# EAGLE design LPC_1TE_3.42 (EAGLE 5.10)
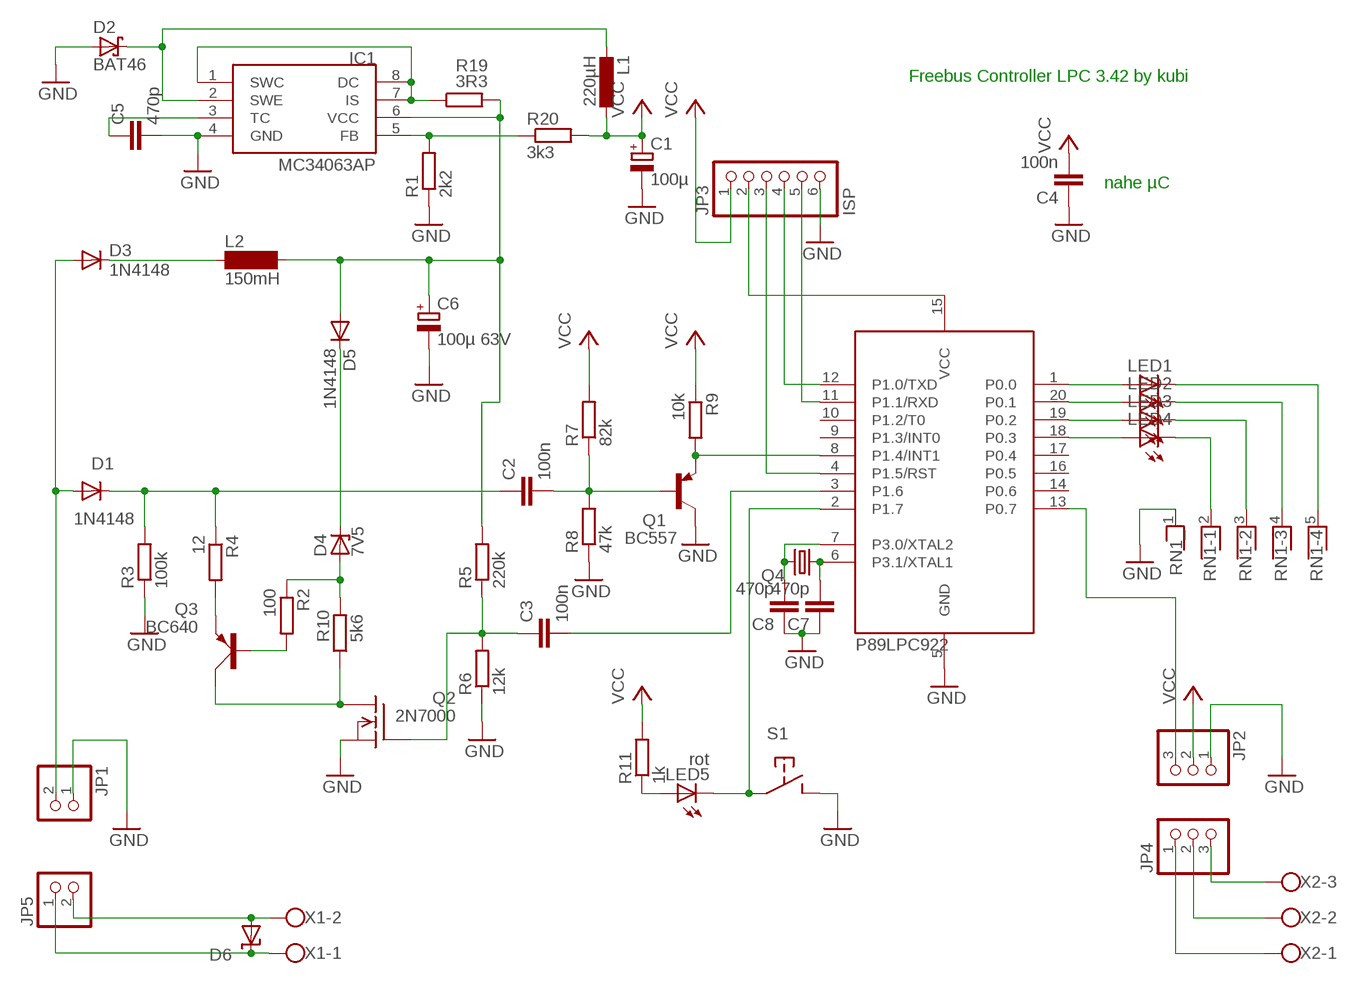
[diagram p0: schematic, sheet 1]

## Parts
C1  100µ  CPOL-EUE5-8.5  [E5-8,5]
C2  100n  C-EU050-024X044  [C050-024X044]
C3  100n  C-EU050-024X044  [C050-024X044]
C4  100n  C-EU050-024X044  [C050-024X044]
C5  470p  C-EU025-024X044  [C025-024X044]
C6  100µ 63V  CPOL-EUE5-10.5  [E5-10,5]
C7  470p  C-EU025-024X044  [C025-024X044]
C8  470p  C-EU025-024X044  [C025-024X044]
D1  1N4148  [DO35-10]
D2  BAT46  BAT49  [DO41-10]
D3  1N4148  [DO35-10]
D4  7V5  ZPD  [DO35Z10]
D5  1N4148  [DO35-10]
D6  SUPPRESSOR-SMBJ  [SMBJ]
IC1  MC34063AP  [DIL08]
JP1  PINHD-1X2  [1X02]
JP2  PINHD-1X3  [1X03]
JP3  ISP  PINHD-1X6  [1X06]
JP4  PINHD-1X3  [1X03]
JP5  PINHD-1X2  [1X02]
L1  220µH  L-EU2200-12.7  [2200-12.7]
L2  150mH  SD12K100  [SD12K100]
LED1  LED3MM  [LED3MM]
LED2  LED3MM  [LED3MM]
LED3  LED3MM  [LED3MM]
LED4  LED3MM  [LED3MM]
LED5  rot  LED3MM  [LED3MM]
Q1  BC557  [TO92]
Q2  2N7000  VN2222KM  [TO237]
Q3  BC640  [SOT54D]
Q4  CRYSTALHC49U-V  [HC49U-V]
R1  2k2  R-EU_0207/10  [0207/10]
R2  100  R-EU_0207/10  [0207/10]
R3  100k  R-EU_0207/10  [0207/10]
R4  12  R-EU_0207/10  [0207/10]
R5  220k  R-EU_0207/10  [0207/10]
R6  12k  R-EU_0207/10  [0207/10]
R7  82k  R-EU_0207/10  [0207/10]
R8  47k  R-EU_0207/10  [0207/10]
R9  10k  R-EU_0207/10  [0207/10]
R10  5k6  R-EU_0207/10  [0207/10]
R11  1k  R-EU_0207/10  [0207/10]
R19  3R3  R-EU_0207/10  [0207/10]
R20  3k3  R-EU_0207/10  [0207/10]
RN1  RNX4  [RN-5]
S1  3305  [3305]
U1  89LPC922  [DIL20]
X1  W237-02P  [W237-132]
X2  W237-03P  [W237-133]

## Nets
GND: C1.- C4.1 C5.2 C6.- C7.1 C8.1 D2.A IC1.4(GND) JP1.1 JP2.1 JP3.6 Q1.3(C) Q2.3(S) R1.1 R3.1 R6.1 R8.1 RN1.1 S1.P$2 U1.5(GND)
N$1: Q1.1(E) R9.2 U1.8(P1.4/INT1)
N$2: C2.2 Q1.2(B) R7.1 R8.2
N$3: IC1.5(FB) R1.2 R20.1
N$4: IC1.1(SWC) IC1.7(IS) IC1.8(DC) R19.1
N$5: C3.2 U1.3(P1.6)
N$6: Q2.1(D) Q3.C R10.1
N$7: C6.+ D5.A IC1.6(VCC) L2.2 R5.2 R19.2
N$8: D3.C L2.1
N$9: C2.1 D1.C R3.2 R4.1
N$10: D2.C IC1.2(SWE) L1.2
N$11: D4.A R2.1 R10.2
N$12: Q3.E R4.2
N$13: C5.1 IC1.3(TC)
N$14: Q3.B R2.2
N$15: LED5.K(C) S1.P$1 U1.2(P1.7)
N$16: D1.A D3.A JP1.2
N$17: D6.A JP5.2 X1.2
N$18: D6.C JP5.1 X1.1
N$19: JP4.3 X2.3
N$20: LED1.A U1.1(P0.0)
N$21: LED2.A U1.20(P0.1)
N$22: LED3.A U1.19(P0.2)
N$23: LED4.A U1.18(P0.3)
N$24: C7.2 Q4.1 U1.6(P3.1/XTAL1)
N$25: C8.2 Q4.2 U1.7(P3.0/XTAL2)
N$26: JP4.2 X2.2
N$27: JP4.1 X2.1
N$28: JP2.3 U1.13(P0.7)
N$29: JP3.4 U1.12(P1.0/TXD)
N$30: JP3.5 U1.11(P1.1/RXD)
N$31: JP3.3 U1.4(P1.5/RST)
N$32: JP3.2 U1.15(VCC)
N$34: C3.1 Q2.2(G) R5.1 R6.2
N$37: LED4.K(C) RN1.2
N$38: LED3.K(C) RN1.3
N$39: LED2.K(C) RN1.4
N$40: D4.C D5.C
N$41: LED5.A R11.1
N$42: LED1.K(C) RN1.5
VCC: C1.+ C4.2 JP2.2 JP3.1 L1.1 R7.2 R9.1 R11.2 R20.2
Unconnected: U1.9(P1.3/INT0) U1.10(P1.2/T0) U1.14(P0.6) U1.16(P0.5) U1.17(P0.4)

## Notes on the sheet
- Freebus Controller LPC 3.42 by kubi
- nahe µC
- P89LPC922

## Library data of the parts
C1 C6 = rcl:CPOL-EU: POLARIZED CAPACITOR, European symbol
C2-C5 C7 C8 = rcl:C-EU: CAPACITOR, European symbol
D1 D3 D5 = diode:1N4148: DIODE high speed (Philips)
D2 = diode:BAT49: DIODE small signal diode
D4 = diode:ZPD: Z DIODE 500 mW
D6 = diode:SUPPRESSOR-: Suppressor diode
IC1 = mc34063:MC34063
JP1 JP5 = pinhead:PINHD-1X2: PIN HEADER
JP2 JP4 = pinhead:PINHD-1X3: PIN HEADER
JP3 = pinhead:PINHD-1X6: PIN HEADER
L1 = rcl:L-EU: INDUCTOR, European symbol
L2 = inductor-neosid:SD12: INDUCTOR nominal inductance
LED1-LED5 = led:LED: LED OSRAM: - CHIPLED LG R971, LG N971, LY N971, LG Q971, LY Q971, LO R971, LY R971 LH N974, LH R974 LS Q976, LO Q976, LY Q976 LO Q996 - Hyper CHIPLED LW Q18S LB Q993, LB Q99A, LB R99A - SideLED LS A670, LO A670, LY A670, LG A670, LP A670 LB A673, LV A673, LT A673, LW A673 LH A674 LY A675 LS A676, LA A676, LO A676, LY A676, LW A676 LS A679, LY A679, LG A679 - Hyper Micro SIDELED® LS Y876, LA Y876, LO Y876, LY Y876 LT Y87S - SmartLED LW L88C, LW L88S LB L89C, LB L89S, LG L890 LS L89K, LO L89K, LY L89K LS L896, LA L896, LO L896, LY L896 - TOPLED LS T670, LO T670, LY T670, LG T670, LP T670 LSG T670, LSP T670, LSY T670, LOP T670, LYG T670 LG T671, LOG T671, LSG T671 LB T673, LV T673, LT T673, LW T673 LH T674 LS T676, LA T676, LO T676, LY T676, LB T676, LH T676, LSB T676, LW T676 LB T67C, LV T67C, LT T67C, LS T67K, LO T67K, LY T67K, LW E67C LS E67B, LA E67B, LO E67B, LY E67B, LB E67C, LV E67C, LT E67C LW T67C LS T679, LY T679, LG T679 LS T770, LO T770, LY T770, LG T770, LP T770 LB T773, LV T773, LT T773, LW T773 LH T774 LS E675, LA E675, LY E675, LS T675 LS T776, LA T776, LO T776, LY T776, LB T776 LHGB T686 LT T68C, LB T68C - Hyper Mini TOPLED® LB M676 - Mini TOPLED Santana® LG M470 LS M47K, LO M47K, LY M47K Source: http://www.osram.convergy.de - LUMILED® LXK2-PW12-R00, LXK2-PW12-S00, LXK2-PW14-U00, LXK2-PW14-V00 LXK2-PM12-R00, LXK2-PM12-S00, LXK2-PM14-U00 LXK2-PE12-Q00, LXK2-PE12-R00, LXK2-PE12-S00, LXK2-PE14-T00, LXK2-PE14-U00 LXK2-PB12-K00, LXK2-PB12-L00, LXK2-PB12-M00, LXK2-PB14-N00, LXK2-PB14-P00, LXK2-PB14-Q00 LXK2-PR12-L00, LXK2-PR12-M00, LXK2-PR14-Q00, LXK2-PR14-R00 LXK2-PD12-Q00, LXK2-PD12-R00, LXK2-PD12-S00 LXK2-PH12-R00, LXK2-PH12-S00 LXK2-PL12-P00, LXK2-PL12-Q00, LXK2-PL12-R00 Source: www.luxeon.com
Q1 = transistor-pnp:BC557: PNP Transistor
Q2 = transistor-fet:VN2222KM: N-Channel Enhancement MOSFET (VMOS); 60V; 0,5A; 7,5Ohm
Q3 = transistor-small-signal:BC640: PNP TRANSISTOR
Q4 = crystal:CRYSTAL: CRYSTAL
R1-R11 R19 R20 = rcl:R-EU_: RESISTOR, European symbol
RN1 = resistor-net:RNX4: RESISTOR NETWORK
S1 = kubi:3305: Taster 3305
U1 = micro-philips:89LPC922
X1 = con-wago-508:W237-02P: WAGO SREW CLAMP
X2 = con-wago-508:W237-03P: WAGO SREW CLAMP

## Board
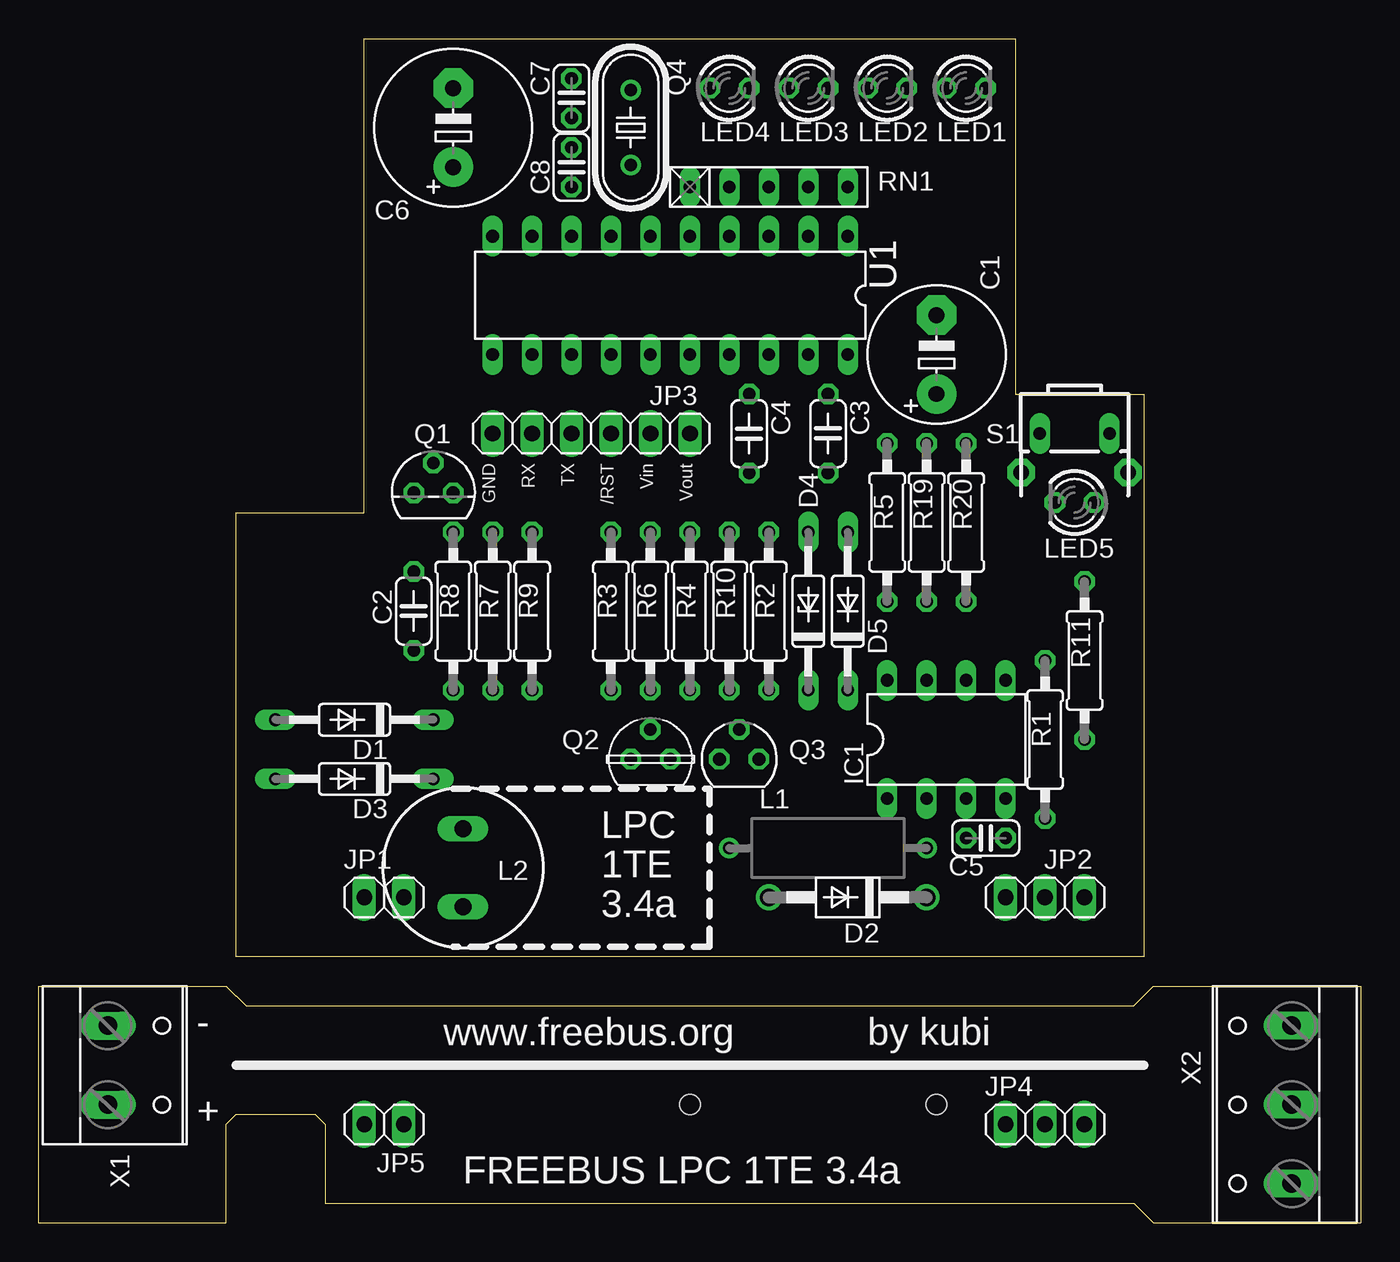
[diagram p1: board, top side]
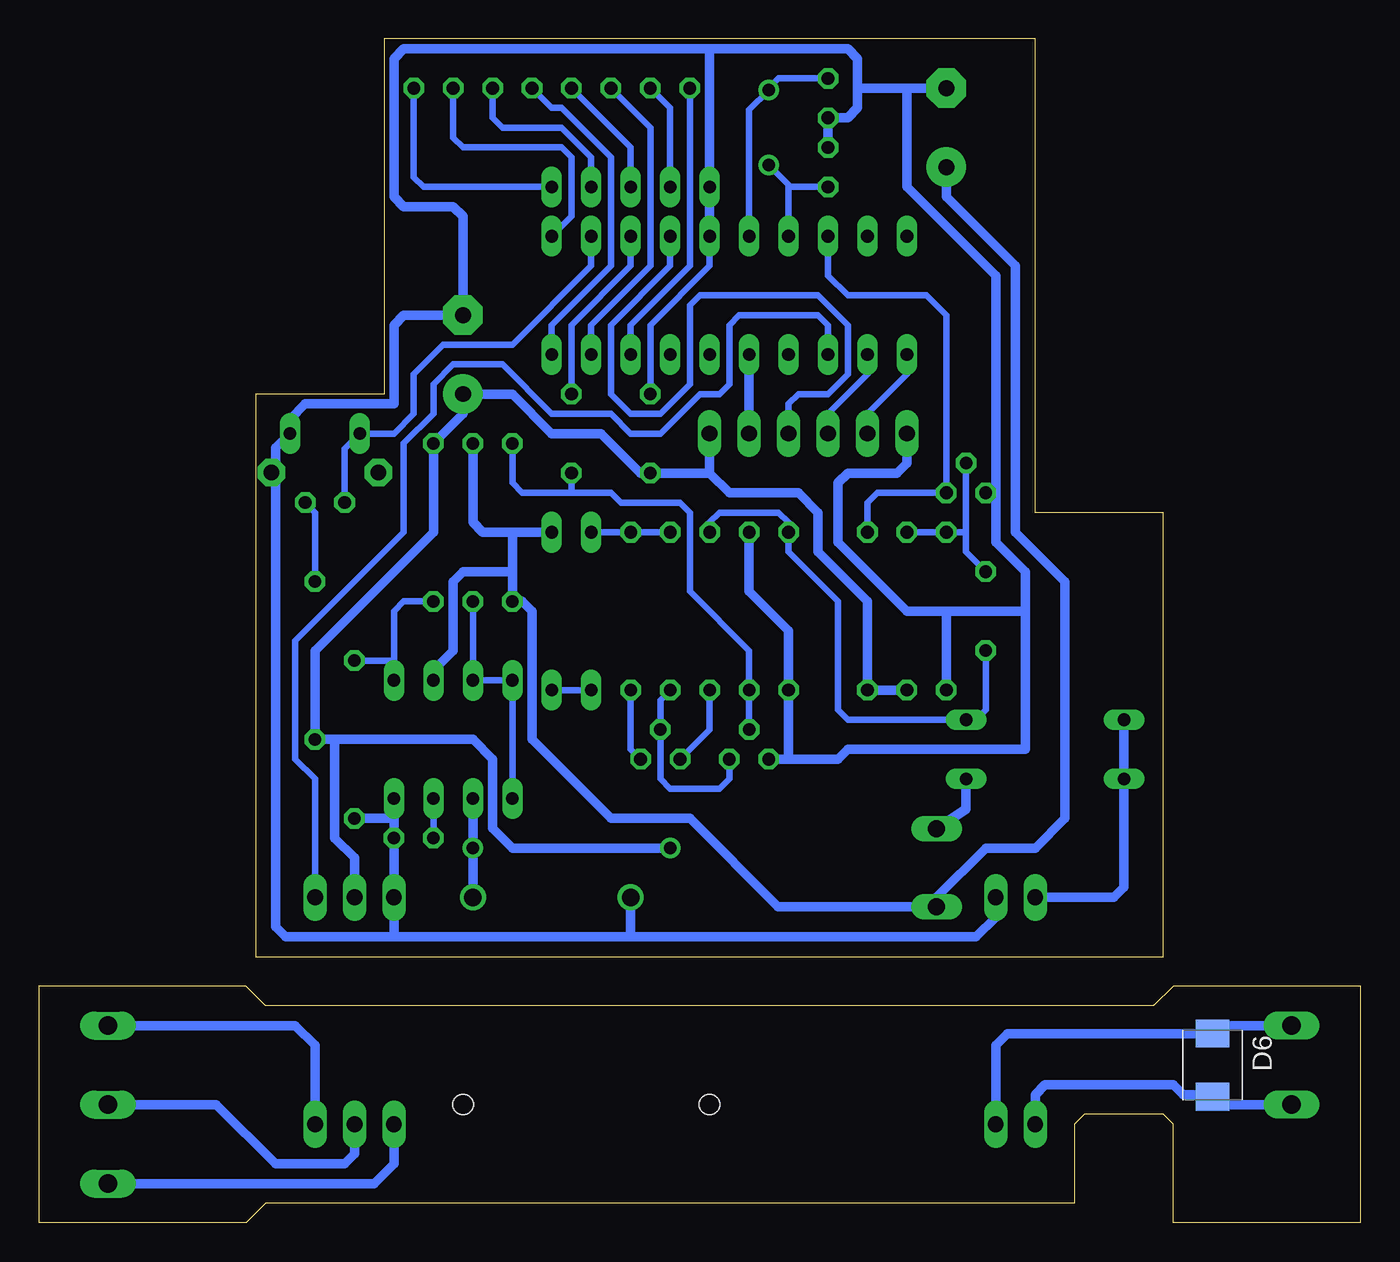
[diagram p2: board, bottom side, seen from below]

Size 85.09 x 76.2 mm. Coordinates in mm from the lower left corner, seen from the top.
Outline: 12.7,17.14 12.7,45.72 20.95,45.72 20.95,76.2 62.87,76.2 62.87,53.34 71.12,53.34 71.12,17.14 12.7,17.14
Outline: 0,0 12.06,0 12.06,6.35 12.7,6.98 17.78,6.98 18.41,6.35 18.41,1.27 70.48,1.27 71.75,0 85.09,0 85.09,15.24 71.75,15.24 70.48,13.97 13.34,13.97 12.06,15.24 0,15.24 0,0
Copper layers (1*16): Top 0.035mm / dielectric 1.5mm / Bottom 0.035mm
Design rules "default *": minimum track width 10mil, minimum drill 24mil, track to track 12mil, track to pad 10mil, pad to pad 12mil, via to via 12mil, smd to smd 8mil, copper to edge 10mil, drill to drill 8mil, minimum pad ring 10mil, minimum via ring 8mil, stop-mask expansion 4mil, vias tented up to drill 0mil, thermal gap 10mil
Holes 1.3 mm at 57.79,7.62 41.91,7.62

### Footprints (pad centres in the part's own frame; a part is rotated, then mirrored left to right if it is on the bottom)
E5-8,5 = drill 1.016 pad 2.54 round: + -2.54,0 | drill 1.016 pad 2.54 octagon: - 2.54,0
C050-024X044 = drill 0.813 octagon: 1 -2.54,0; 2 2.54,0
C025-024X044 = drill 0.813 octagon: 1 -1.27,0; 2 1.27,0
E5-10,5 = drill 1.016 pad 2.54 round: + -2.54,0 | drill 1.016 pad 2.54 octagon: - 2.54,0
DO35-10 = drill 0.813 long: A 5.08,0; C -5.08,0
DO41-10 = drill 1.118 round: A 5.08,0; C -5.08,0
DO35Z10 = drill 0.813 long: A 5.08,0; C -5.08,0
SMBJ = smd 1.78 x 2.16: A 2.04,0; C -2.03,0
DIL08 = drill 0.813 long: 1 -3.81,-3.81; 2 -1.27,-3.81; 3 1.27,-3.81; 4 3.81,-3.81; 5 3.81,3.81; 6 1.27,3.81; 7 -1.27,3.81; 8 -3.81,3.81
1X02 = drill 1.016 long: 1 -1.27,0; 2 1.27,0
1X03 = drill 1.016 long: 1 -2.54,0; 2 0,0; 3 2.54,0
1X06 = drill 1.016 long: 1 -6.35,0; 2 -3.81,0; 3 -1.27,0; 4 1.27,0; 5 3.81,0; 6 6.35,0
2200-12.7 = drill 0.8 pad 1.27 round: 1 -6.35,0; 2 6.35,0
SD12K100 = drill 1.1 long: 1 -2.5,0; 2 2.5,0
LED3MM = drill 0.813 octagon: A -1.27,0; K 1.27,0
TO92 = drill 0.813 octagon: 1 1.27,0; 2 0,1.905; 3 -1.27,0
TO237 = drill 0.813 octagon: 1 1.27,0; 2 0,1.905; 3 -1.27,0
SOT54D = drill 0.813 octagon: B 1.27,0; C 0,1.905; E -1.27,0
HC49U-V = drill 0.813 round: 1 -2.413,0; 2 2.413,0
0207/10 = drill 0.813 octagon: 1 -5.08,0; 2 5.08,0
RN-5 = drill 0.813 long: 1 -5.08,0; 2 -2.54,0; 3 0,0; 4 2.54,0; 5 5.08,0
3305 = drill 0.8 long: P$1 -2.25,0; P$2 2.25,0 | drill 1 pad 1.778 octagon: P$3 -3.45,-2.5; P$4 3.45,-2.5
DIL20 = drill 0.813 long: 1 -11.43,-3.81; 2 -8.89,-3.81; 3 -6.35,-3.81; 4 -3.81,-3.81; 5 -1.27,-3.81; 6 1.27,-3.81; 7 3.81,-3.81; 8 6.35,-3.81; 9 8.89,-3.81; 10 11.43,-3.81; 11 11.43,3.81; 12 8.89,3.81; 13 6.35,3.81; 14 3.81,3.81; 15 1.27,3.81; 16 -1.27,3.81; 17 -3.81,3.81; 18 -6.35,3.81; 19 -8.89,3.81; 20 -11.43,3.81
W237-132 = drill 1.194 long: 1 -2.54,-0.635; 2 2.54,-0.635
W237-133 = drill 1.194 long: 1 -5.08,-0.635; 2 0,-0.635; 3 5.08,-0.635

### Placement (x,y rotation side)
C1  57.79,55.88 90 top
C2  24.13,39.37 90 top
C3  50.8,50.8 90 top
C4  45.72,50.8 270 top
C5  60.96,24.77 0 top
C6  26.67,70.48 90 top
C7  34.29,72.39 90 top
C8  34.29,67.94 270 top
D1  20.32,32.38 180 top
D2  52.07,20.95 180 top
D3  20.32,28.57 180 top
D4  49.53,39.37 90 top
D5  52.07,39.37 90 top
D6  9.53,10.16 270 bottom
IC1  58.42,31.11 0 top
JP1  22.22,20.95 180 top
JP2  64.77,20.95 0 top
JP3  35.56,50.8 180 top
JP4  64.77,6.35 0 top
JP5  22.22,6.35 180 top
L1  50.8,24.13 0 top
L2  27.3,22.86 270 top
LED1  59.69,73.02 0 top
LED2  54.61,73.02 0 top
LED3  49.53,73.02 0 top
LED4  44.45,73.02 0 top
LED5  66.67,46.36 180 top
Q1  25.4,46.99 0 top
Q2  39.37,29.84 0 top
Q3  45.09,29.84 0 top
Q4  38.1,70.48 270 top
R1  64.77,31.11 90 top
R2  46.99,39.37 270 top
R3  36.83,39.37 90 top
R4  41.91,39.37 270 top
R5  54.61,45.09 270 top
R6  39.37,39.37 270 top
R7  29.21,39.37 270 top
R8  26.67,39.37 90 top
R9  31.75,39.37 90 top
R10  44.45,39.37 90 top
R11  67.31,36.2 270 top
R19  57.15,45.09 90 top
R20  59.69,45.09 90 top
RN1  46.99,66.67 0 top
S1  66.67,50.8 0 top
U1  40.64,59.69 180 top
X1  5.08,10.16 270 top
X2  80.01,7.62 90 top

### Tracks (layer width: path | path; a pad name or v marks a point on that pad's centre or on a via)
GND
  Bottom 0.406: U1.5 41.91,61.6 45.72,57.79 C4.1
  Bottom 0.61: JP3.6 29.21,48.9 29.84,48.26 33.02,48.26 33.66,47.62 33.66,43.82 29.21,39.37 26.67,39.37 | 23.49,46.99 Q1.3 | R6.1 39.37,40.64 36.83,38.1 R3.1 36.83,29.84 | 36.83,29.84 Q2.3 | 62.23,26.04 C5.2 JP2.1 62.23,18.41 | 62.23,26.04 IC1.4 | U1.5 RN1.1 41.91,75.56 | 62.23,26.04 R1.1 | 41.91,75.56 61.59,75.56 62.23,74.93 62.23,66.04 61.59,65.41 58.42,65.41 57.79,64.77 C1.- 61.59,58.42 62.23,57.79 62.23,52.71 67.94,52.71 68.92,51.73 S1.P$2 69.85,49.88 69.85,19.05 69.21,18.41 62.23,18.41 | 26.67,39.37 R8.1 | 36.83,29.84 33.66,29.84 33.02,30.48 21.59,30.48 21.59,39.37 | JP1.1 23.49,19.68 24.76,18.41 46.99,18.41 | C8.1 C7.1 33.02,71.12 32.39,71.75 32.39,73.02 | 32.39,73.02 32.39,74.93 33.02,75.56 41.91,75.56 | 32.39,73.02 29.21,73.02 | 29.21,73.02 C6.- | 29.21,73.02 29.21,66.67 23.49,60.96 23.49,46.99 | 23.49,46.99 23.49,43.82 21.59,41.91 21.59,39.37 | 21.59,39.37 26.67,39.37 | 46.99,18.41 D2.A | 46.99,18.41 62.23,18.41
N$1
  Bottom 0.406: U1.8 34.29,60.96 33.02,59.69 27.94,59.69 26.67,58.42 Q1.1 31.11,46.99 31.75,46.36 R9.2
N$2
  Bottom 0.406: R7.1 R8.2 25.4,44.45 | 25.4,44.45 25.4,43.18 C2.2 | 25.4,44.45 Q1.2
N$3
  Bottom 0.406: R20.1 61.59,40.01 62.23,39.37 62.23,36.2 | IC1.5 62.23,36.2 | 62.23,36.2 R1.2
N$4
  Bottom 0.406: IC1.1 IC1.8 IC1.7 R19.1
N$5
  Bottom 0.406: U1.3 46.99,61.6 50.8,57.79 C3.2
N$6
  Bottom 0.406: R10.1 45.09,33.66 Q3.C 45.09,28.57 44.45,27.94 41.27,27.94 40.64,28.57 Q2.1
N$7
  Bottom 0.61: 54.61,44.45 D5.A | 54.61,41.91 R5.2 53.98,40.01 53.34,39.37 53.34,31.11 48.26,26.04 43.18,26.04 37.51,20.36 L2.2 27.3,20.95 24.13,24.13 20.95,24.13 19.05,26.04 19.05,41.28 22.22,44.45 22.22,61.6 26.67,66.04 C6.+ | 54.61,41.91 54.61,44.45 | R19.2 57.15,45.09 56.52,44.45 54.61,44.45 | 54.61,41.91 57.79,41.91 58.42,41.28 58.42,36.83 59.69,35.56 IC1.6
N$8
  Bottom 0.61: D3.C 25.4,26.63 L2.1
N$9
  Bottom 0.406: R4.1 41.91,45.09 41.27,45.72 37.47,45.72 36.83,45.09 R3.2 36.83,43.18 33.66,40.01 33.66,33.02 33.02,32.38 D1.C 24.76,32.38 24.13,33.02 C2.1
N$10
  Bottom 0.61: D2.C L1.2 IC1.2
N$11
  Bottom 0.406: D4.A R2.1 R10.2
N$12
  Bottom 0.406: R4.2 41.91,31.75 Q3.E
N$13
  Bottom 0.406: C5.1 IC1.3
N$14
  Bottom 0.406: Q3.B 46.99,30.48 R2.2
N$15
  Bottom 0.406: U1.2 49.53,61.6 54.61,56.52 59.05,56.52 60.96,54.61 60.96,52.07 62.23,50.8 S1.P$1 65.41,49.82 LED5.K
N$16
  Bottom 0.61: JP1.2 15.88,20.95 15.24,21.59 D3.A D1.A
N$17
  Bottom 0.61: X1.2 9.03,7.62 D6.A 9.66,8.26 11.43,8.26 12.06,8.89 20.32,8.89 20.95,8.26 JP5.2
N$18
  Bottom 0.61: X1.1 9.02,12.7 D6.C 22.73,12.19 23.49,11.43 JP5.1
N$19
  Bottom 0.61: JP4.3 67.31,11.43 68.58,12.7 X2.3
N$20
  Bottom 0.406: LED1.A 58.42,69.85 57.79,69.21 51.44,69.21 50.8,68.58 50.8,64.77 U1.1
N$21
  Bottom 0.406: U1.20 52.07,57.79 48.26,61.6 48.26,68.58 51.44,71.75 52.07,71.75 LED2.A
N$22
  Bottom 0.406: U1.19 49.53,57.79 45.72,61.6 45.72,70.48 LED3.A
N$23
  Bottom 0.406: U1.18 46.99,57.79 43.18,61.6 LED4.A
N$24
  Bottom 0.406: U1.6 39.37,71.63 Q4.1 38.1,73.02 37.47,73.66 C7.2
N$25
  Bottom 0.406: 36.83,66.67 U1.7 | 36.83,66.67 36.83,66.8 Q4.2 | C8.2 36.83,66.67
N$26
  Bottom 0.61: JP4.2 64.77,4.45 65.41,3.81 69.85,3.81 73.66,7.62 X2.2
N$27
  Bottom 0.61: JP4.1 62.23,3.81 63.5,2.54 X2.1
N$28
  Bottom 0.406: U1.13 34.29,57.79 34.93,58.42 40.01,58.42 40.64,57.79 40.64,53.98 41.27,53.34 42.55,53.34 45.09,50.8 46.99,50.8 48.26,52.07 52.07,52.07 55.25,55.25 58.42,55.25 59.69,53.98 59.69,52.07 61.59,50.17 61.59,44.45 68.58,37.47 68.58,29.84 67.31,28.57 JP2.3
N$29
  Bottom 0.406: U1.12 31.75,54.61 34.29,52.07 JP3.4
N$30
  Bottom 0.406: U1.11 29.21,54.61 31.75,52.07 JP3.5
N$31
  Bottom 0.406: U1.4 44.45,61.6 48.26,57.79 48.26,53.34 46.99,52.07 45.09,52.07 43.18,53.98 43.18,59.05 42.55,59.69 34.93,59.69 33.02,57.79 33.02,54.61 34.29,53.34 36.2,53.34 36.83,52.71 JP3.3
N$32
  Bottom 0.61: JP3.2 U1.15
N$34
  Bottom 0.406: Q2.2 R6.2 39.37,36.83 43.18,40.64 43.18,45.72 43.82,46.36 47.62,46.36 48.26,46.99 50.8,46.99 | 50.8,46.99 53.98,46.99 54.61,47.62 R5.1 | 50.8,46.99 C3.1
N$37
  Bottom 0.406: RN1.2 44.45,71.75 LED4.K
N$38
  Bottom 0.406: RN1.3 46.99,69.21 LED3.K
N$39
  Bottom 0.406: RN1.4 49.53,68.58 51.44,70.48 55.25,70.48 55.88,71.12 LED2.K
N$40
  Bottom 0.406: D4.C D5.C
N$41
  Bottom 0.406: R11.1 67.31,45.72 LED5.A
N$42
  Bottom 0.406: RN1.5 60.33,66.67 60.96,67.31 LED1.K
VCC
  Bottom 0.61: R7.2 R9.1 31.75,40.01 34.93,43.18 34.93,45.72 36.2,46.99 40.64,46.99 41.91,48.26 | 41.91,48.26 JP3.1 | 41.91,48.26 C4.2 46.36,48.26 48.9,50.8 52.07,50.8 54.61,53.34 C1.+ 57.79,52.07 R20.2 59.69,44.45 67.31,36.83 R11.2 66.04,31.11 | 49.53,24.13 L1.1 54.61,24.13 55.88,25.4 55.88,29.84 57.15,31.11 66.04,31.11 | JP2.2 64.77,23.5 66.04,24.77 66.04,31.11

### Text on the board
tPlace: GND | RX | TX | /RST | Vin | Vout
tNames: LPC | 1TE | 3.4a | - | www.freebus.org | by kubi | + | FREEBUS LPC 1TE 3.4a